# EAGLE design mattduino_uno (EAGLE 9.1.2)

## Sheet 1 of 4
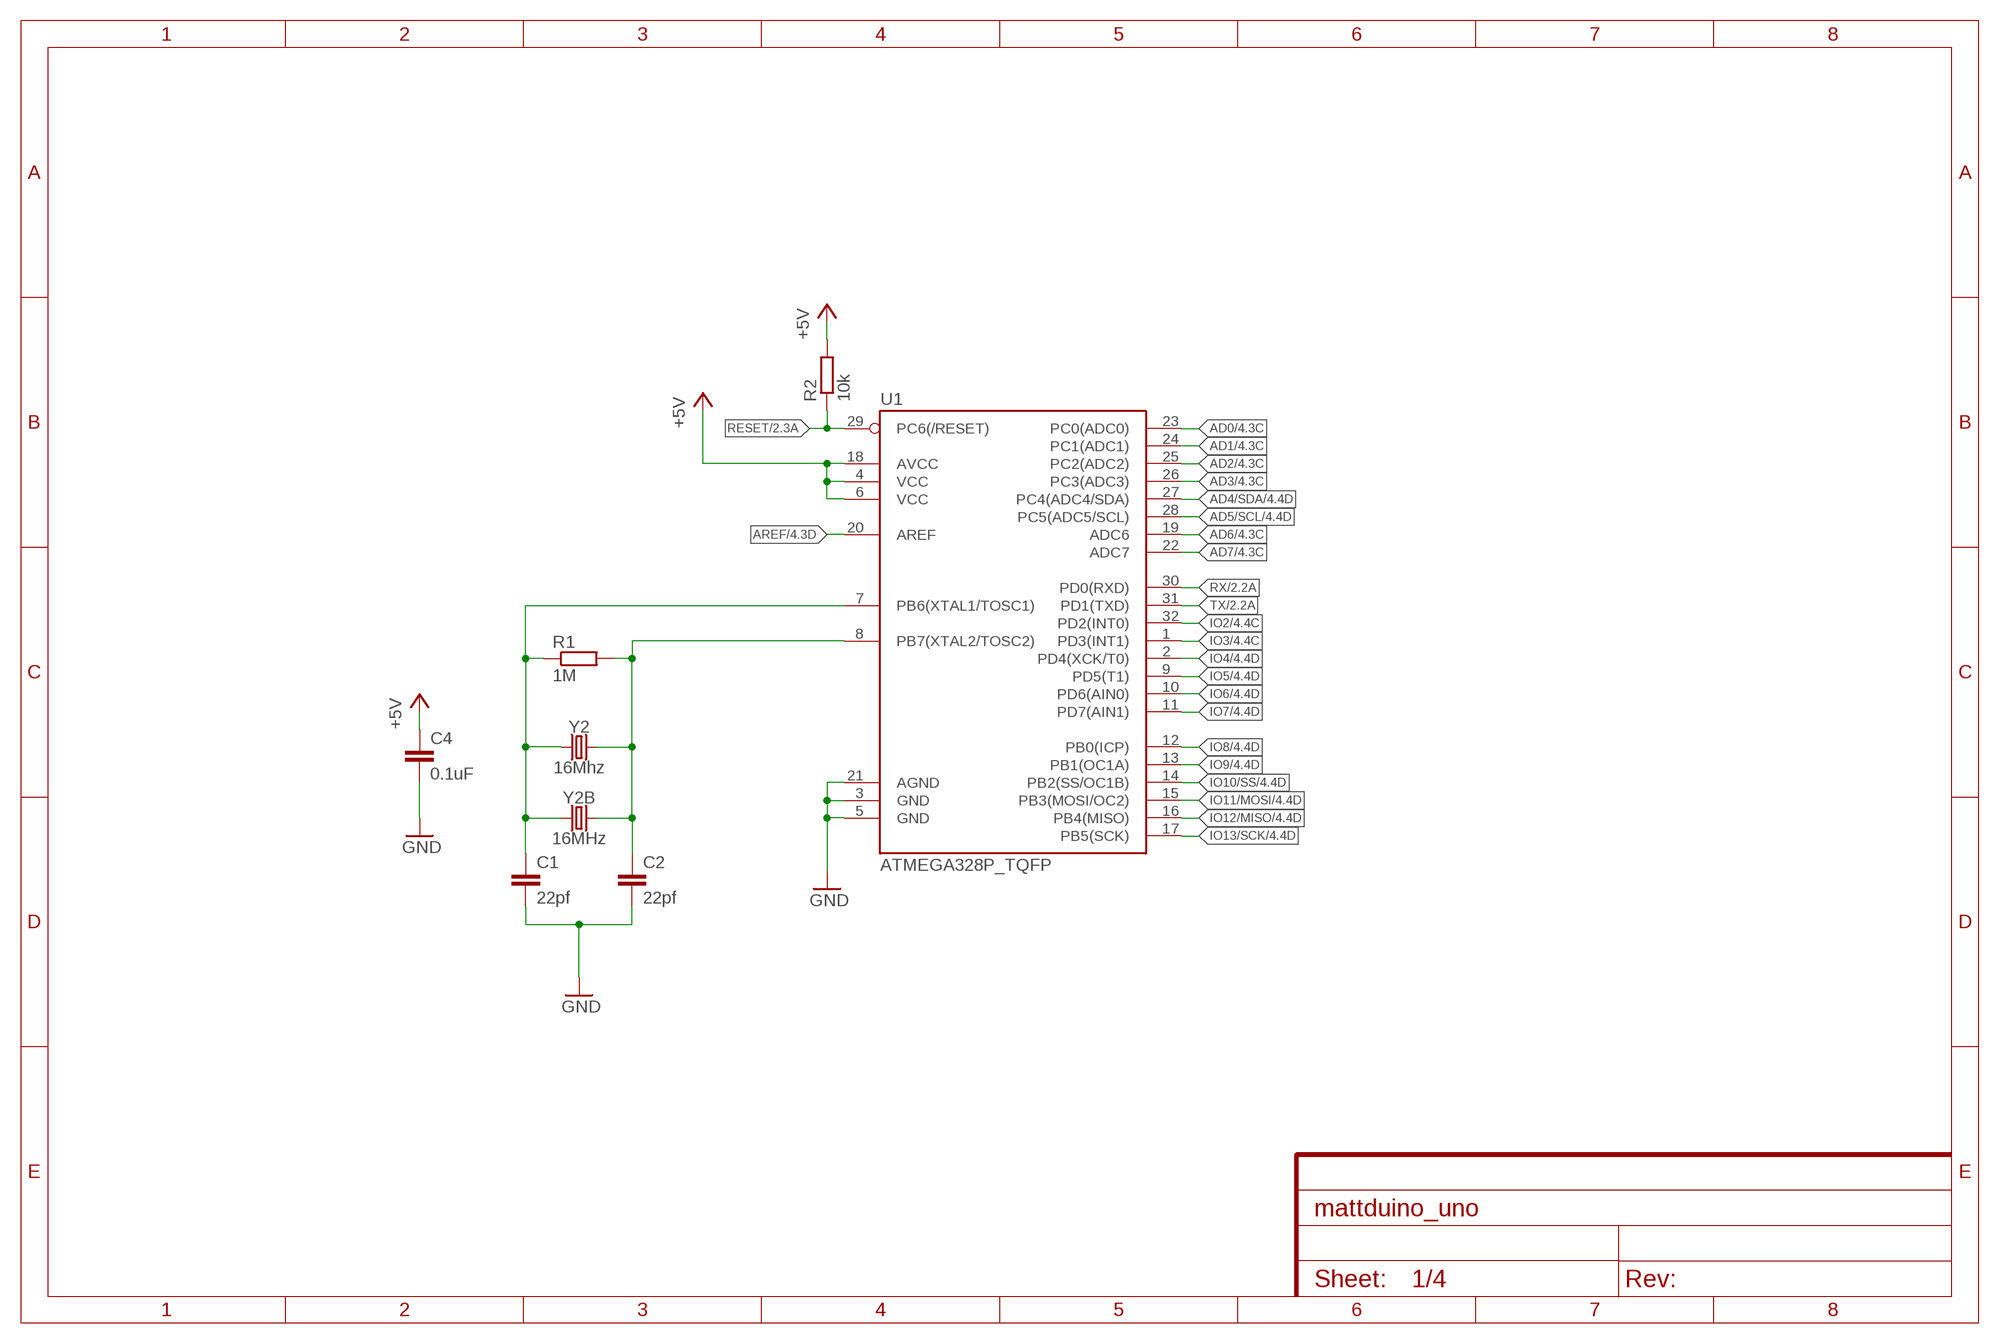
[diagram p0: schematic, sheet 1]

### Parts
C1  22pf  C-EUC0603  [C0603]
C2  22pf  C-EUC0603  [C0603]
C4  0.1uF  C-EUC0603  [C0603]
R1  1M  R-EU_R0603  [R0603]
R2  10k  R-EU_R0603  [R0603]
U1  ATMEGA328P_TQFP  [TQFP32-08]
Y2  16Mhz  CRYSTAL-8MHZSMD-HC49UP  [HC49UP]
Y2B  16MHz  CRYSTALPTH-HC49UV  [HC49U]

### Nets
328_OSC1: C1.1 R1.1 U1.7(PB6(XTAL1/TOSC1)) Y2.1 Y2B.1
328_OSC2: C2.1 R1.2 U1.8(PB7(XTAL2/TOSC2)) Y2.2 Y2B.2
+5V [power usb]: C4.1 R2.2 U1.4(VCC) U1.6(VCC) U1.18(AVCC) ; also sheet 2,3,4
AD0: U1.23(PC0(ADC0)) ; also sheet 4
AD1: U1.24(PC1(ADC1)) ; also sheet 4
AD2: U1.25(PC2(ADC2)) ; also sheet 4
AD3: U1.26(PC3(ADC3)) ; also sheet 4
AD4/SDA: U1.27(PC4(ADC4/SDA)) ; also sheet 4
AD5/SCL: U1.28(PC5(ADC5/SCL)) ; also sheet 4
AD6: U1.19(ADC6) ; also sheet 4
AD7: U1.22(ADC7) ; also sheet 4
AREF: U1.20(AREF) ; also sheet 4
GND [gnd]: C1.2 C2.2 C4.2 U1.3(GND) U1.5(GND) U1.21(AGND) ; also sheet 2,3,4
IO2: U1.32(PD2(INT0)) ; also sheet 4
IO3: U1.1(PD3(INT1)) ; also sheet 4
IO4: U1.2(PD4(XCK/T0)) ; also sheet 4
IO5: U1.9(PD5(T1)) ; also sheet 4
IO6: U1.10(PD6(AIN0)) ; also sheet 4
IO7: U1.11(PD7(AIN1)) ; also sheet 4
IO8: U1.12(PB0(ICP)) ; also sheet 4
IO9: U1.13(PB1(OC1A)) ; also sheet 4
IO10/SS: U1.14(PB2(SS/OC1B)) ; also sheet 4
IO11/MOSI: U1.15(PB3(MOSI/OC2)) ; also sheet 4
IO12/MISO: U1.16(PB4(MISO)) ; also sheet 4
IO13/SCK: U1.17(PB5(SCK)) ; also sheet 4
RESET: R2.1 U1.29(PC6(/RESET)) ; also sheet 2,4
RX: U1.30(PD0(RXD)) ; also sheet 2,4
TX: U1.31(PD1(TXD)) ; also sheet 2,4

## Sheet 2 of 4
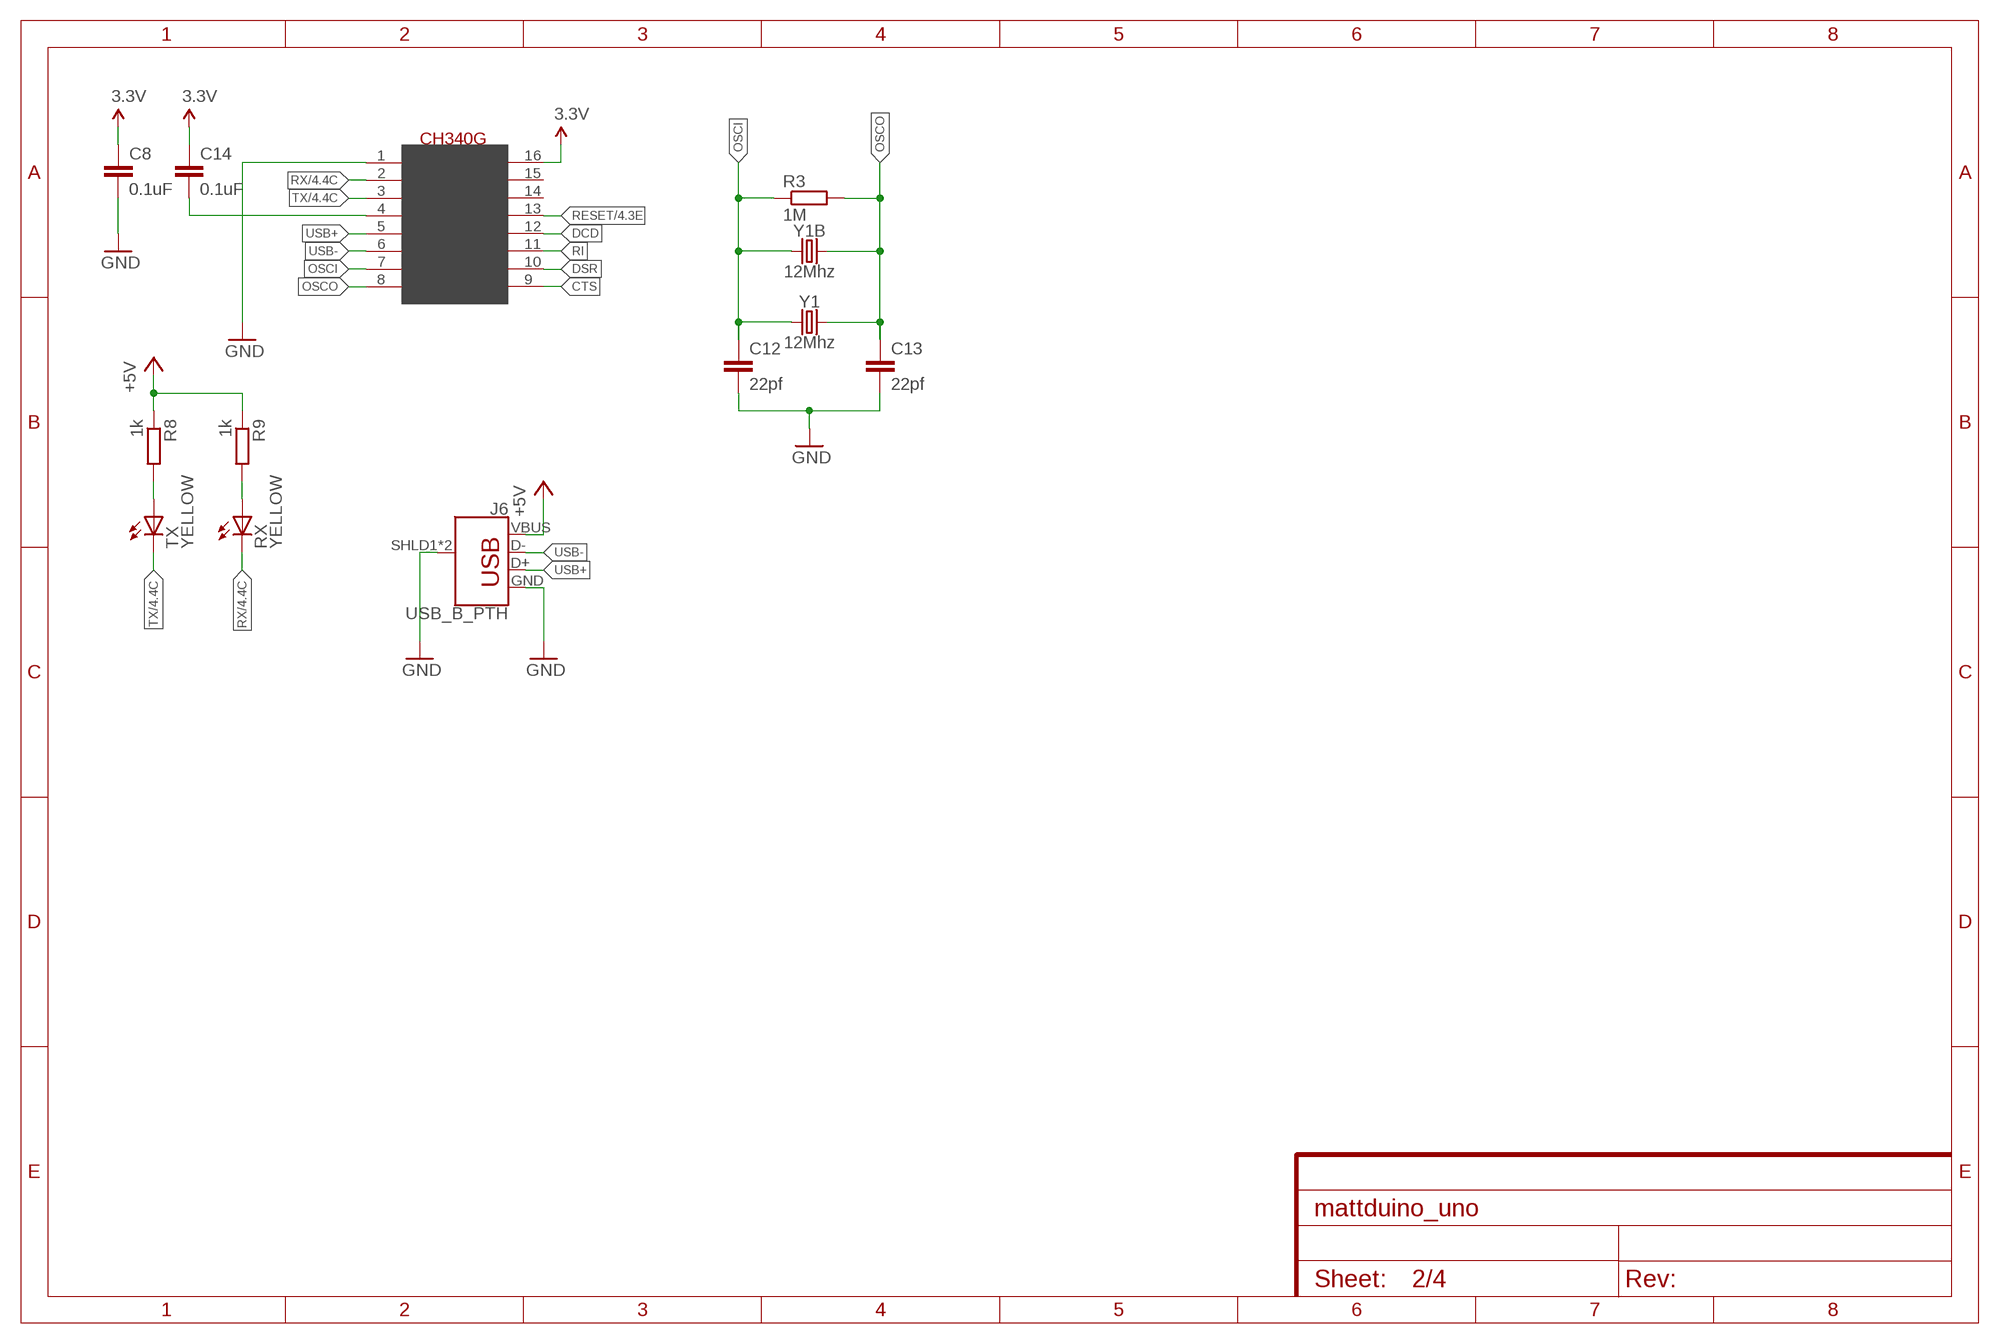
[diagram p1: schematic, sheet 2]

### Parts
C8  0.1uF  C-EUC0603  [C0603]
C12  22pf  C-EUC0603  [C0603]
C13  22pf  C-EUC0603  [C0603]
C14  0.1uF  C-EUC0603  [C0603]
IC3  CH340G  [SOIC16]
J6  USB_B_PTH  [USB-B-PTH]
R3  1M  R-EU_R0603  [R0603]
R8  1k  R-EU_R0603  [R0603]
R9  1k  R-EU_R0603  [R0603]
RX  YELLOW  LEDCHIP-LED0603  [CHIP-LED0603]
TX  YELLOW  LEDCHIP-LED0603  [CHIP-LED0603]
Y1  12Mhz  CRYSTALPTH-HC49UV  [HC49U]
Y1B  12Mhz  CRYSTAL-8MHZSMD-HC49UP  [HC49UP]

### Nets
3.3V: C8.1 C14.1 IC3.16(VCC) ; also sheet 3,4
+5V [power usb]: J6.VBUS R8.1 R9.1 ; also sheet 1,3,4
CTS: IC3.9(CTS)
DCD: IC3.12(DCD)
DSR: IC3.10(DSR)
GND [gnd]: C8.2 C12.2 C13.2 IC3.1(GND) J6.GND J6.SHLD1(SHIELD) J6.SHLD2(SHIELD) ; also sheet 1,3,4
N$5: R8.2 TX.A
N$6: R9.2 RX.A
OSCI: C12.1 IC3.7(XI) R3.1 Y1.1 Y1B.1
OSCO: C13.1 IC3.8(XO) R3.2 Y1.2 Y1B.2
RESET: IC3.13(DTR) ; also sheet 1,4
RI: IC3.11(RI)
RX: IC3.2(TX) RX.C ; also sheet 1,4
TX: IC3.3(RX) TX.C ; also sheet 1,4
USB+: IC3.5(D+) J6.D+
USB-: IC3.6(D-) J6.D-
V3: C14.2 IC3.4(V3)
Unconnected: IC3.14(RTS) IC3.15(RS232)

## Sheet 3 of 4
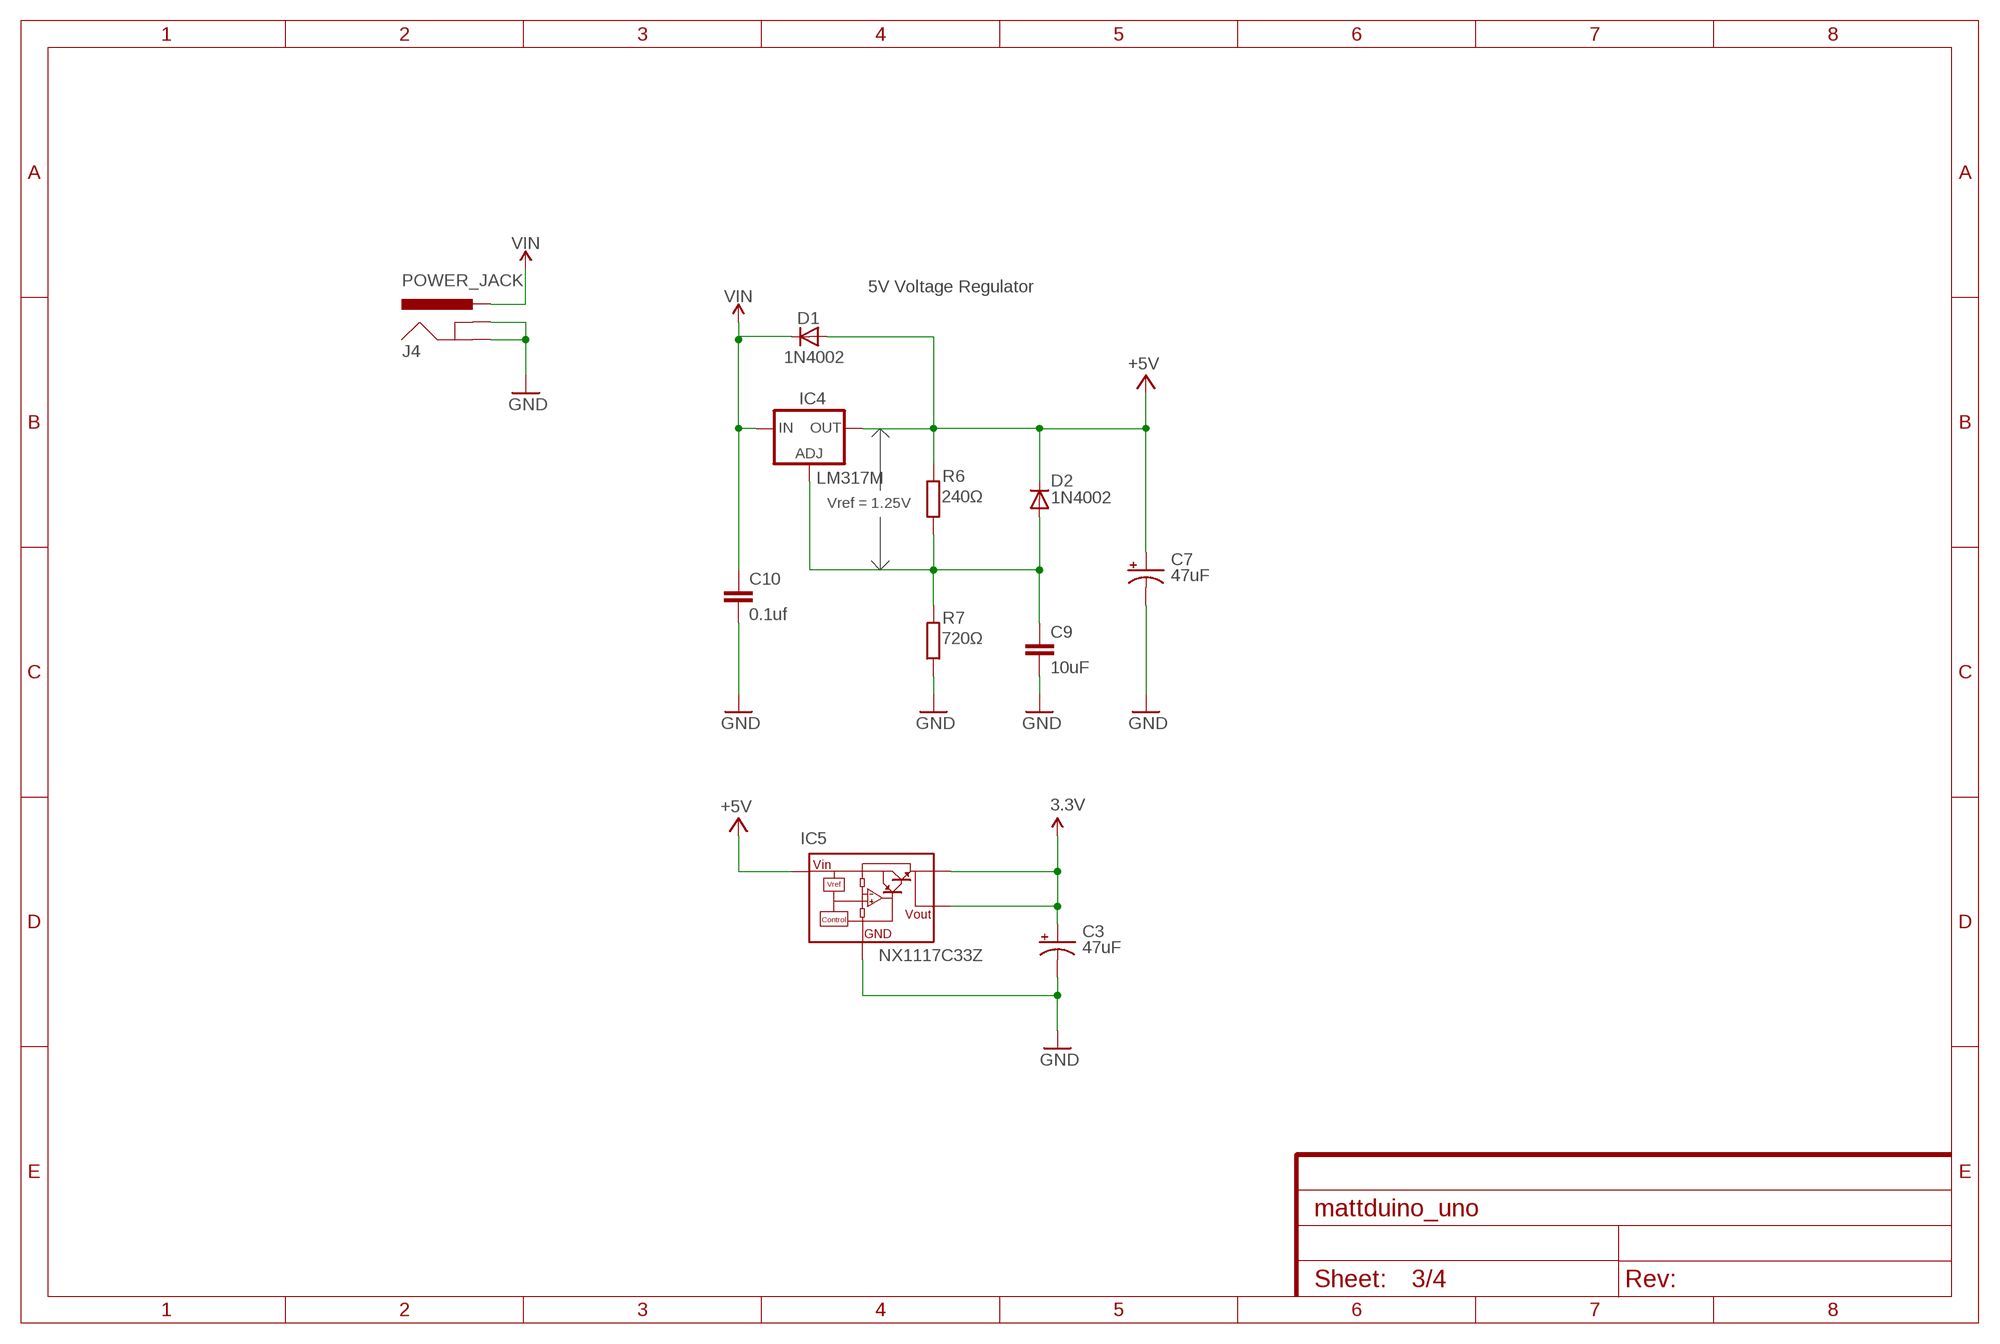
[diagram p2: schematic, sheet 3]

### Parts
C3  47uF  47UF-POLAR-PANASONIC_D-35V-20%  [PANASONIC_D]
C7  47uF  47UF-POLAR-PANASONIC_D-35V-20%  [PANASONIC_D]
C9  10uF  C-EUC0603  [C0603]
C10  0.1uf  C-EUC0603  [C0603]
D1  1N4002  DIODESOD-123  [SOD-123]
D2  1N4002  DIODESOD-123  [SOD-123]
IC4  LM317MBSTT3  [SOT223]
IC5  NX1117C33Z  [SOT223]
J4  POWER_JACK  [POWER_JACK_PTH]
R6  240Ω  R-EU_R0603  [R0603]
R7  720Ω  R-EU_R0603  [R0603]

### Nets
3.3V: C3.+ IC5.2(VOUT1) IC5.4(VOUT) ; also sheet 2,4
+5V [power usb]: C7.+ D1.A D2.C IC4.4(OUT) IC5.3(VIN) R6.2 ; also sheet 1,2,4
GND [gnd]: C3.- C7.- C9.2 C10.2 IC5.1(GND) J4.GND J4.GNDBREAK R7.1 ; also sheet 1,2,4
N$1: C9.1 D2.A IC4.1(ADJ) R6.1 R7.2
VIN: C10.1 D1.C IC4.3(IN) J4.PWR ; also sheet 4

### Notes on the sheet
- 5V Voltage Regulator
- Vref = 1.25V

## Sheet 4 of 4
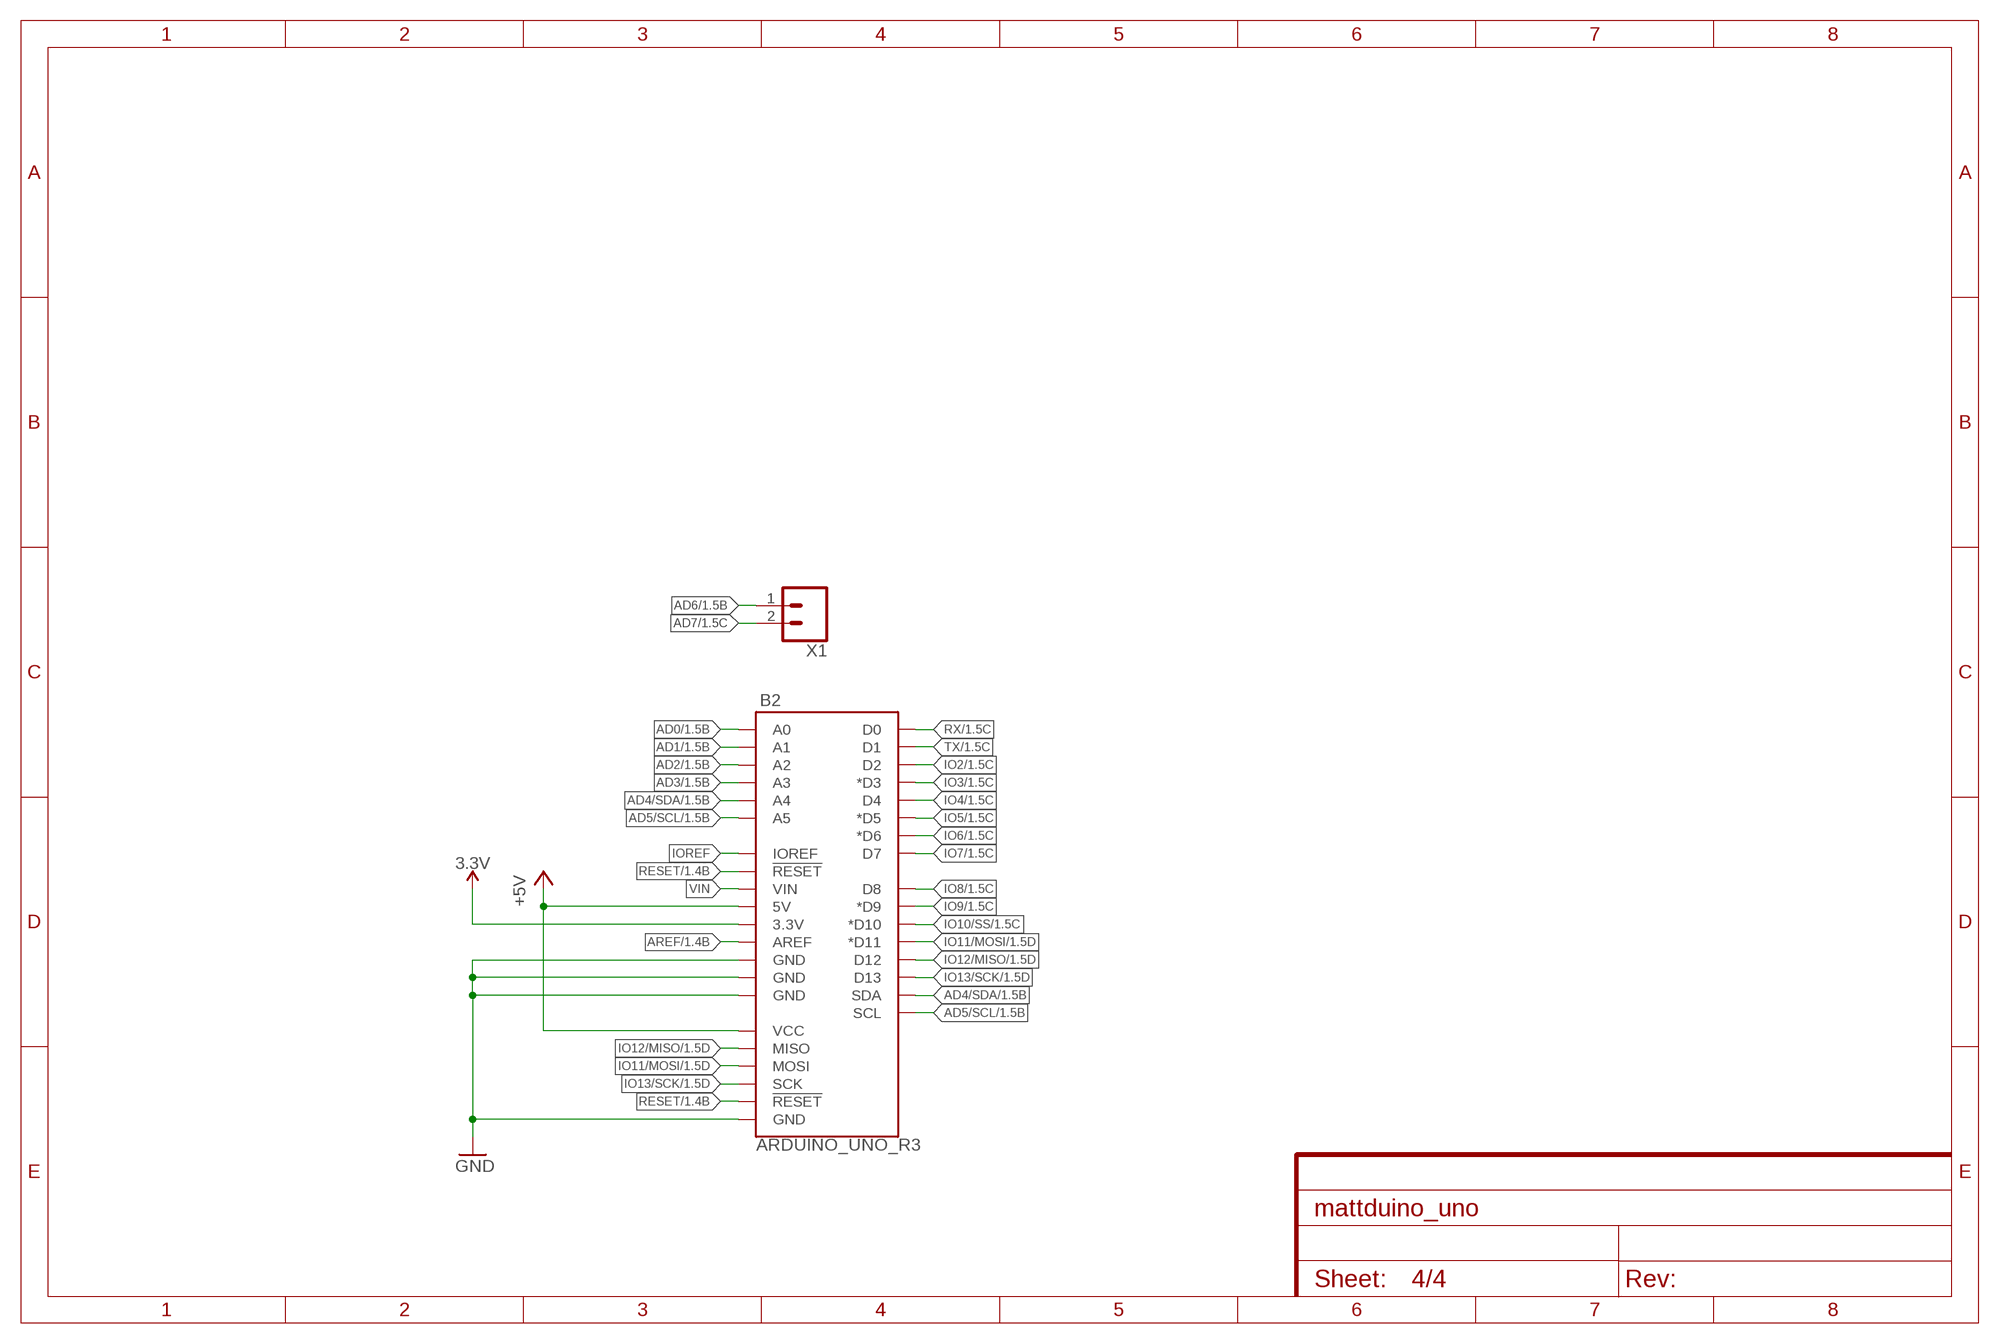
[diagram p3: schematic, sheet 4]

### Parts
B2  ARDUINO_UNO_R3  [ARDUINO_R3]
X1  CONN_02  [1X02]

### Nets
3.3V: B2.3.3V ; also sheet 2,3
+5V [power usb]: B2.5V B2.VCC ; also sheet 1,2,3
AD0: B2.A0 ; also sheet 1
AD1: B2.A1 ; also sheet 1
AD2: B2.A2 ; also sheet 1
AD3: B2.A3 ; also sheet 1
AD4/SDA: B2.A4 B2.SDA ; also sheet 1
AD5/SCL: B2.A5 B2.SCL ; also sheet 1
AD6: X1.1 ; also sheet 1
AD7: X1.2 ; also sheet 1
AREF: B2.AREF ; also sheet 1
GND [gnd]: B2.GND@1(GND) B2.GND@2(GND) B2.GND@3(GND) B2.GND@4(GND) ; also sheet 1,2,3
IO2: B2.D2 ; also sheet 1
IO3: B2.D3(*D3) ; also sheet 1
IO4: B2.D4 ; also sheet 1
IO5: B2.D5(*D5) ; also sheet 1
IO6: B2.D6(*D6) ; also sheet 1
IO7: B2.D7 ; also sheet 1
IO8: B2.D8 ; also sheet 1
IO9: B2.D9(*D9) ; also sheet 1
IO10/SS: B2.D10(*D10) ; also sheet 1
IO11/MOSI: B2.D11(*D11) B2.MOSI ; also sheet 1
IO12/MISO: B2.D12 B2.MISO ; also sheet 1
IO13/SCK: B2.D13 B2.SCK ; also sheet 1
IOREF: B2.IOREF
RESET: B2.RESET@1(!RESET!) B2.RESET@2(!RESET!) ; also sheet 1,2
RX: B2.D0 ; also sheet 1,2
TX: B2.D1 ; also sheet 1,2
VIN: B2.VIN ; also sheet 3

## Library data of the parts
B2 = SparkFun-Boards:ARDUINO_UNO_R3: Arduino R3 Footprint with SPI header Arduino Uno R3 Compatible Footprint. Matches PCB size of the original board. SparkFun Products: SAMD21 Dev Breakout <https://www.sparkfun.com/products/13672> RedBoard <https://www.sparkfun.com/products/12757> R3 Stackable Headers <https://www.sparkfun.com/products/11417>
C1 C2 C4 C8-C10 C12 C14 = rcl:C-EU: CAPACITOR, European symbol; SPICEPREFIX: C
C3 C7 = SparkFun-Capacitors:47UF-POLAR: 47µF polarized capacitors A capacitor is a passive two-terminal electrical component used to store electrical energy temporarily in an electric field.; PROD_ID: CAP-08478
C13 = rcl:C-EU: CAPACITOR, European symbol
D1 D2 = adafruit:DIODE: Diode SMADIODE - SMA Surface Mount Package 20V 1A Schottky Diode Digikey: 641-1014-6-ND DO-1N4148 - Through Hole Small Current Diode SOD-123 20V 1 A (.5mV Vf) Schottky Diode - Digikey: MBRX120TPMSCT-ND SOD-323 10V 570mA (.38mV Vf, 3ns) Schottky Diode - Digikey: ZLLS410CT-ND SOD-523 30V 30mA Schottky Diode (RB751S-40TE61) - Digikey: RB751S-40TE61CT-ND SOT23-R/W - SOT23 Package (R = Solder Paste/Reflow Ovens, W = Hand-Soldering) BAT54Film 40V 300mA - Digikey: 497-7162-1-ND
IC3 = CH340G-USB-SERIAL:CH340G
IC4 = v-reg:LM317?*: 500 mA Adjustable Output Positive Voltage Regulator Source: http://www.onsemi.co.jp .. LM317M-D.PDF; PARTNUMBER: LM317M
IC5 = nxp_60:NX1117C: The NX1117C/NX1117CE are two series of low-dropout positive voltage regulators with an output current capability of 1 A. AAL Eindhoven MK; 12NC: 9352 914 42115; TOLERANCE: 1.25%; VOLTAGE: 5.0V
J4 = SparkFun-Connectors:POWER_JACK: Power Jack Connector This is the standard 5.5mm barrel jack for power. The PTH is the most common, proven, reliable, footprint. The Slot footprint only works if the mill layer is transmitted to the PCB fab house so be warned. Here are the connectors we sell at SparkFun: DC Barrel Power Jack/Connector <https://www.sparkfun.com/products/119> (PRT-00119) DC Barrel Power Jack/Connector (SMD) <https://www.sparkfun.com/products/12748> (PRT-12748) DC Barrel Jack Adapter - Breadboard Compatible <https://www.sparkfun.com/products/10811> (PRT-10811) It is used on this SparkFun product (and many, many others): SparkFun RedBoard - Programmed with Arduino <https://www.sparkfun.com/products/12757> (DEV-12757) Also, if you need a mating power supply or connector, please check these out: Wall Adapter Power Supply - 9VDC 650mA <https://www.sparkfun.com/products/298> (TOL-00298) DC Barrel Jack Adapter - Male <https://www.sparkfun.com/products/10287> (PRT-10287); PROD_ID: CONN-08197
J6 = SparkFun-Connectors:USB_B: USB Type B Connector SparkFun Products: SparkFun Stepoko <https://www.sparkfun.com/products/13899> PTH; PROD_ID: CONN-08278; SF_ID: PRT-00139
R1-R3 R6-R9 = rcl:R-EU_: RESISTOR, European symbol; SPICEPREFIX: R
RX TX = led:LED: LED OSRAM: - CHIPLED LG R971, LG N971, LY N971, LG Q971, LY Q971, LO R971, LY R971 LH N974, LH R974 LS Q976, LO Q976, LY Q976 LO Q996 - Hyper CHIPLED LW Q18S LB Q993, LB Q99A, LB R99A - SideLED LS A670, LO A670, LY A670, LG A670, LP A670 LB A673, LV A673, LT A673, LW A673 LH A674 LY A675 LS A676, LA A676, LO A676, LY A676, LW A676 LS A679, LY A679, LG A679 - Hyper Micro SIDELED® LS Y876, LA Y876, LO Y876, LY Y876 LT Y87S - SmartLED LW L88C, LW L88S LB L89C, LB L89S, LG L890 LS L89K, LO L89K, LY L89K LS L896, LA L896, LO L896, LY L896 - TOPLED LS T670, LO T670, LY T670, LG T670, LP T670 LSG T670, LSP T670, LSY T670, LOP T670, LYG T670 LG T671, LOG T671, LSG T671 LB T673, LV T673, LT T673, LW T673 LH T674 LS T676, LA T676, LO T676, LY T676, LB T676, LH T676, LSB T676, LW T676 LB T67C, LV T67C, LT T67C, LS T67K, LO T67K, LY T67K, LW E67C LS E67B, LA E67B, LO E67B, LY E67B, LB E67C, LV E67C, LT E67C LW T67C LS T679, LY T679, LG T679 LS T770, LO T770, LY T770, LG T770, LP T770 LB T773, LV T773, LT T773, LW T773 LH T774 LS E675, LA E675, LY E675, LS T675 LS T776, LA T776, LO T776, LY T776, LB T776 LHGB T686 LT T68C, LB T68C - Hyper Mini TOPLED® LB M676 - Mini TOPLED Santana® LG M470 LS M47K, LO M47K, LY M47K Source: http://www.osram.convergy.de LUXEON: - LUMILED® LXK2-PW12-R00, LXK2-PW12-S00, LXK2-PW14-U00, LXK2-PW14-V00 LXK2-PM12-R00, LXK2-PM12-S00, LXK2-PM14-U00 LXK2-PE12-Q00, LXK2-PE12-R00, LXK2-PE12-S00, LXK2-PE14-T00, LXK2-PE14-U00 LXK2-PB12-K00, LXK2-PB12-L00, LXK2-PB12-M00, LXK2-PB14-N00, LXK2-PB14-P00, LXK2-PB14-Q00 LXK2-PR12-L00, LXK2-PR12-M00, LXK2-PR14-Q00, LXK2-PR14-R00 LXK2-PD12-Q00, LXK2-PD12-R00, LXK2-PD12-S00 LXK2-PH12-R00, LXK2-PH12-S00 LXK2-PL12-P00, LXK2-PL12-Q00, LXK2-PL12-R00 Source: www.luxeon.com KINGBRIGHT: KA-3528ASYC Source: www.kingbright.com
U1 = SparkFun-IC-Microcontroller:ATMEGA328P_TQFP: Popular 328P in QFP Storefront component: ATmega328 - TQFP <https://www.sparkfun.com/products/13448> (COM-13448) Datasheet <http://www.sparkfun.com/datasheets/Components/SMD/ATMega328.pdf> SparkFun Products SparkFun RedBoard - Programmed with Arduino <https://www.sparkfun.com/products/12757> (DEV-12757) Arduino Pro Mini 328 - 5V/16MHz <https://www.sparkfun.com/products/11113> (DEV-11113) Arduino Pro Mini 328 - 3.3V/8MHz <https://www.sparkfun.com/products/11114> (DEV-11114) SparkFun OpenLog <https://www.sparkfun.com/products/13712> (DEV-13712) SparkFun MicroView - OLED Arduino Module <https://www.sparkfun.com/products/12923> (DEV-12923) SparkFun Digital Sandbox <https://www.sparkfun.com/products/12651> (DEV-12651) SparkFun PicoBoard <https://www.sparkfun.com/products/11888> (WIG-11888) Arduino Fio <https://www.sparkfun.com/products/10116> (DEV-10116) LilyPad Arduino 328 Main Board <https://www.sparkfun.com/products/13342> (DEV-13342) SparkFun RedStick <https://www.sparkfun.com/products/13741> (DEV-13741) LilyPad MP3 <https://www.sparkfun.com/products/11013> (DEV-11013) LilyPad Arduino SimpleSnap <https://www.sparkfun.com/products/10941> (DEV-10941) SparkFun Stepoko <https://www.sparkfun.com/products/13899> (ROB-13899) SparkFun Geiger Counter <https://www.sparkfun.com/products/11345> (SEN-11345) SparkFun EL Sequencer <https://www.sparkfun.com/products/12781> (COM-12781) Arduino Pro 328 - 5V/16MHz <https://www.sparkfun.com/products/10915> (DEV-10915) CryptoCape <https://www.sparkfun.com/products/12773> (DEV-12773) SparkFun IR Thermometer Evaluation Board - MLX90614 <https://www.sparkfun.com/products/10740> (SEN-10740) SparkFun RedBot Mainboard <https://www.sparkfun.com/products/12097> (ROB-12097) Arduino Pro 328 - 3.3V/8MHz <https://www.sparkfun.com/products/10914> (DEV-10914) SparkFun Block for Intel® Edison - Arduino <https://www.sparkfun.com/products/13036> (DEV-13036) SparkFun Simon Says - Surface Mount Soldering Kit <https://www.sparkfun.com/products/10935> (KIT-10935) SparkFun 7-Segment Serial Display - Red <https://www.sparkfun.com/products/11441> (COM-11441) SparkFun 7-Segment Serial Display - White <https://www.sparkfun.com/products/11629> (COM-11629) SparkFun 7-Segment Serial Display - Yellow <https://www.sparkfun.com/products/11443> (COM-11443) SparkFun 7-Segment Serial Display - Kelly Green <https://www.sparkfun.com/products/11440> (COM-11440) SparkFun 7-Segment Serial Display - Blue <https://www.sparkfun.com/products/11442> (COM-11442) SparkFun OpenSegment Serial Display - 20mm (Blue) <https://www.sparkfun.com/products/11647> (COM-11647) SparkFun OpenSegment Serial Display - 20mm (Green) <https://www.sparkfun.com/products/11646> (COM-11646) SparkFun OpenSegment Serial Display - 20mm (White) <https://www.sparkfun.com/products/11648> (COM-11648) SparkFun OpenSegment Serial Display - 20mm (Red) <https://www.sparkfun.com/products/11644> (COM-11644) SparkFun OpenSegment Serial Display - 20mm (Yellow) <https://www.sparkfun.com/products/11645> (COM-11645) SparkFun OpenSegment Shield <https://www.sparkfun.com/products/13190> (DEV-13190); PROD_ID: IC-09069
X1 = SparkFun-Connectors:CONN_02: Multi connection point. Often used as Generic Header-pin footprint for 0.1 inch spaced/style header connections On any of the 0.1 inch spaced packages, you can populate with these: Break Away Headers - Straight <https://www.sparkfun.com/products/116> (PRT-00116) Break Away Male Headers - Right Angle <https://www.sparkfun.com/products/553> (PRT-00553) Female Headers <https://www.sparkfun.com/products/115> (PRT-00115) Break Away Headers - Machine Pin <https://www.sparkfun.com/products/117> (PRT-00117) Break Away Female Headers - Swiss Machine Pin <https://www.sparkfun.com/products/743> (PRT-00743) For SCREWTERMINALS and SPRING TERMINALS visit here: Screw Terimnals on SparkFun.com <https://www.sparkfun.com/search/results?term=Screw+Terminals> (5mm/3.5mm/2.54mm spacing) This device is also useful as a general connection point to wire up your design to another part of your project. Our various solder wires solder well into these plated through hole pads. Hook-Up Wire - Assortment (Stranded, 22 AWG) <https://www.sparkfun.com/products/11375> (PRT-11375) Hook-Up Wire - Assortment (Solid Core, 22 AWG) <https://www.sparkfun.com/products/11367> (PRT-11367) View the entire wire category on our website here <https://www.sparkfun.com/categories/141> Special notes: Molex polarized connector foot print use with: PRT-08233 with associated crimp pins and housings. 2.54_SCREWTERM for use with PRT-10571. 3.5mm Screw Terminal footprints for PRT-08084 5mm Screw Terminal footprints for use with PRT-08432
Y1 Y2B = SparkFun-Clocks:CRYSTAL: Crystals (Generic) These are passive quartz crystals, which can be used as a clock source for a microcontroller. Crystal's are two-terminal devices. They require external "load" capacitors to generate an oscillating signal.
Y1B Y2 = SparkFun-Clocks:CRYSTAL-8MHZ: 8MHz Crystal Datasheet Example <http://www.futureelectronics.com/en/technologies/electromechanical/timing-devices/crystals/Pages/6008189-ABM3B-8.000MHZ-B2-T.aspx?IM=0> Frequency: 8MHz Frequency Tolerance: ±20ppm Load Capacitance: 18pF SparkFun Products: Pro Micro -3.3V/8MHz <https://www.sparkfun.com/products/12587> WAV Trigger <https://www.sparkfun.com/products/13660>; PROD_ID: XTAL-11706; VALUE: 8MHz

## Net classes
2 gnd: width 0.305 mm, drill 0.406 mm, clearance 0.203 mm
3 power usb: width 0.508 mm, drill 0.406 mm, clearance 0.203 mm

## Board
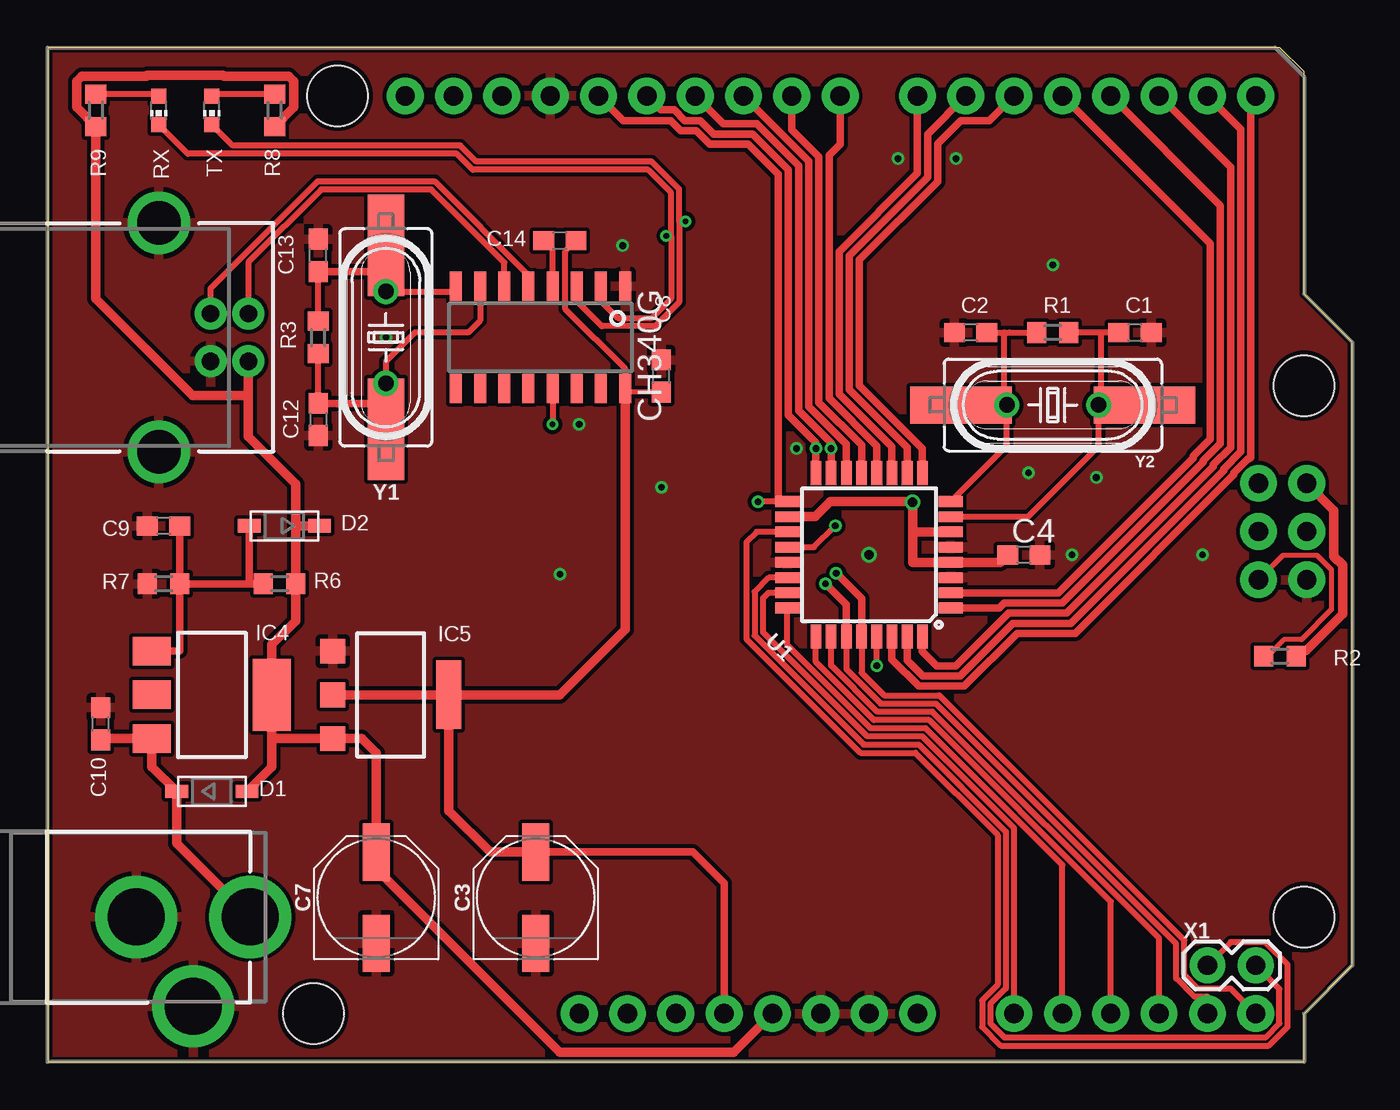
[diagram p4: board, top side]
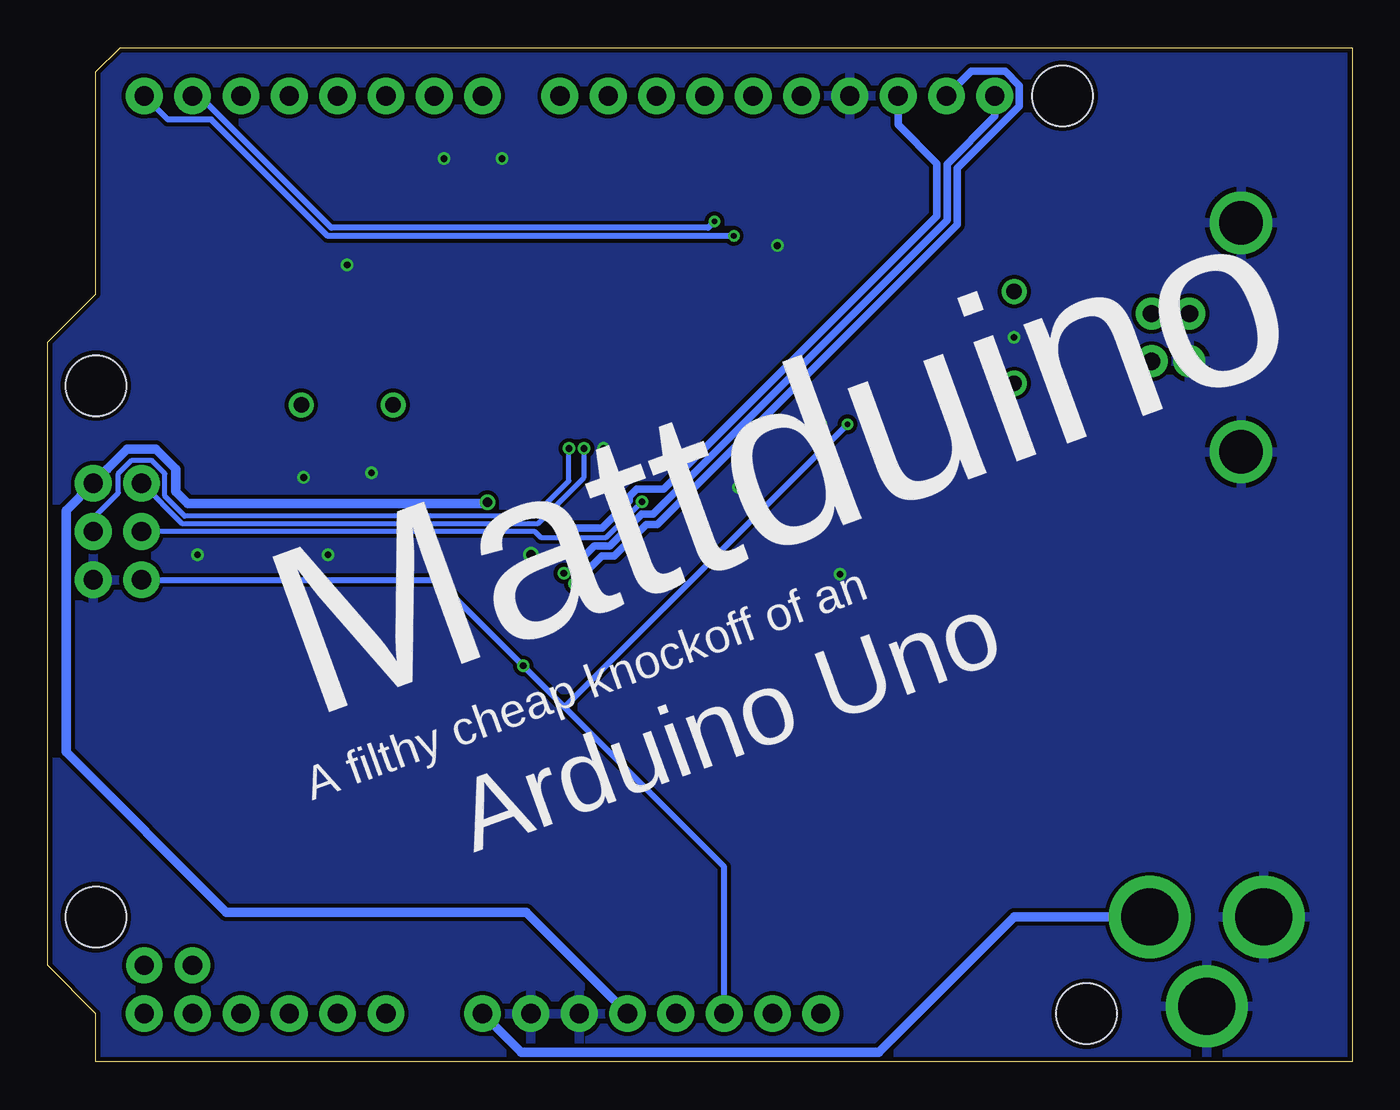
[diagram p5: board, bottom side, seen from below]

Size 68.58 x 53.34 mm. Coordinates in mm from the lower left corner, seen from the top.
Outline: 0,0 66.04,0 66.04,2.54 68.58,5.08 68.58,37.85 66.04,40.39 66.04,52.07 64.77,53.34 0,53.34 0,0
Copper layers (1*16): Top 0.035mm / dielectric 1.5mm / Bottom 0.035mm
Design rules "dirtypcbs": minimum track width 5mil, minimum drill 12mil, track to track 5mil, track to pad 5mil, pad to pad 5mil, via to via 5mil, smd to smd 0mil, copper to edge 10mil, drill to drill 10mil, minimum pad ring 10mil, minimum via ring 6mil, stop-mask expansion 2mil, vias tented up to drill 25mil, thermal gap 10mil

### Footprints (pad centres in the part's own frame; a part is rotated, then mirrored left to right if it is on the bottom)
ARDUINO_R3 = drill 1.016 pad 1.93: 3.3V 2.54,-24.13; 5V 5.08,-24.13; A0 17.78,-24.13; A1 20.32,-24.13; A2 22.86,-24.13; A3 25.4,-24.13; A4 27.94,-24.13; A5 30.48,-24.13; AREF -9.144,24.13; D0 30.48,24.13; D1 27.94,24.13; D2 25.4,24.13; D3 22.86,24.13; D4 20.32,24.13; D5 17.78,24.13; D6 15.24,24.13; D7 12.7,24.13; D8 8.636,24.13; D9 6.096,24.13; D10 3.556,24.13; D11 1.016,24.13; D12 -1.524,24.13; D13 -4.064,24.13; GND@1 7.62,-24.13; GND@2 10.16,-24.13; GND@3 -6.604,24.13; GND@4 33.16,-1.32; IOREF -2.54,-24.13; MISO 30.62,3.76; MOSI 33.16,1.22; NC -5.08,-24.13; RESET@1 0,-24.13; RESET@2 30.62,-1.32; SCK 30.62,1.22; SCL -14.224,24.13; SDA -11.684,24.13; VCC 33.16,3.76; VIN 12.7,-24.13 | hole 3.175: -17.78,24.13; 33.02,8.89; 33.02,-19.05; -19.05,-24.13
C0603 = smd 1.1 x 1: 1 -0.85,0; 2 0.85,0
PANASONIC_D = smd 3 x 1.4: + 2.4,0; - -2.4,0
SOD-123 = smd 1.2 x 0.7: A 1.85,0; C -1.85,0
SOIC16 = smd 0.635 x 1.524: 1 -4.445,-2.695; 2 -3.175,-2.695; 3 -1.905,-2.695; 4 -0.635,-2.695; 5 0.635,-2.695; 6 1.905,-2.695; 7 3.175,-2.695; 8 4.445,-2.695; 9 4.445,2.695; 10 3.175,2.695; 11 1.905,2.695; 12 0.635,2.695; 13 -0.635,2.695; 14 -1.905,2.695; 15 -3.175,2.695; 16 -4.445,2.695
SOT223 = smd 1.5 x 2: 1 -2.3,-3.15; 2 0,-3.15; 3 2.3,-3.15 | smd 3.8 x 2: 4 0,3.15
SOT223' = smd 1.3 x 1.3: 1 -2.3,-3.05; 2 0,-3.05; 3 2.3,-3.05 | smd 3.6 x 1.3: 4 0,3.05
POWER_JACK_PTH = drill 2.997 pad 4.318: GND 0,7.7; GNDBREAK 4.7,10.7; PWR 0,13.7
USB-B-PTH = drill 0.914 pad 1.676: D+ 4,1.25; D- 5.981,1.25; GND 4,-1.25; VBUS 5.981,-1.25 | drill 2.286: SHLD1 1.282,-6.02; SHLD2 1.282,6.02
R0603 = smd 1 x 1.1: 1 -0.85,0; 2 0.85,0
CHIP-LED0603 = smd 0.8 x 0.8: A 0,-0.75; C 0,0.75
TQFP32-08 = smd 1.27 x 0.559: 1 -4.293,2.8; 2 -4.293,2; 3 -4.293,1.2; 4 -4.293,0.4; 5 -4.293,-0.4; 6 -4.293,-1.2; 7 -4.293,-2; 8 -4.293,-2.8; 17 4.293,-2.8; 18 4.293,-2; 19 4.293,-1.2; 20 4.293,-0.4; 21 4.293,0.4; 22 4.293,1.2; 23 4.293,2; 24 4.293,2.8 | smd 0.559 x 1.27: 9 -2.8,-4.293; 10 -2,-4.293; 11 -1.2,-4.293; 12 -0.4,-4.293; 13 0.4,-4.293; 14 1.2,-4.293; 15 2,-4.293; 16 2.8,-4.293; 25 2.8,4.293; 26 2,4.293; 27 1.2,4.293; 28 0.4,4.293; 29 -0.4,4.293; 30 -1.2,4.293; 31 -2,4.293; 32 -2.8,4.293
1X02 = drill 1.016 pad 1.88: 1 0,0; 2 2.54,0
HC49U = drill 0.813: 1 -2.413,0; 2 2.413,0
HC49UP = smd 5.334 x 1.93: 1 -4.826,0; 2 4.826,0

### Placement (x,y rotation side)
B2  33.02,26.67 0 top
C1  57.15,38.35 0 top
C2  48.51,38.35 180 top
C3  25.65,8.64 90 top
C4  51.31,26.67 0 top
C7  17.27,8.64 90 top
C8  32.26,36.07 90 top
C9  6.1,28.19 180 top
C10  2.79,17.78 90 top
C12  14.22,33.78 270 top
C13  14.22,42.42 90 top
C14  26.92,43.18 180 top
D1  8.64,14.22 0 top
D2  12.45,28.19 180 top
IC3  25.91,38.1 180 top
IC4  8.64,19.3 270 top
IC5  NX1117C33Z  [SOT223']  18.03,19.3 270 top
J4  -3.05,7.62 270 top
J6  4.57,38.1 0 top
R1  52.83,38.35 180 top
R2  64.77,21.34 0 top
R3  14.22,38.1 90 top
R6  12.19,25.15 0 top
R7  6.1,25.15 0 top
R8  11.94,50.04 90 top
R9  2.54,50.04 90 top
RX  5.84,50.04 180 top
TX  8.64,50.04 180 top
U1  43.18,26.67 180 top
X1  60.96,5.08 0 top
Y1  17.78,38.1 90 top
Y1B  17.78,38.1 90 top
Y2  52.83,34.54 180 top
Y2B  52.83,34.54 180 top

### Tracks (layer width: path | path; a pad name or v marks a point on that pad's centre or on a via)
3.3V
  Top 0.254: C8.1 30.52,35.22 30.35,35.05
  Top 0.305: IC3.16 30.35,36.45 27.22,39.59 27.22,42.62 C14.1 | 30.35,33.27 30.35,31.75 30.35,30.98
  Top 0.406: B2.3.3V 35.56,9.4 33.92,11.04 C3.+
  Top 0.508: IC5.2 IC5.4 | C3.+ 23.25,11.04 21.08,13.21 IC5.4 | IC3.16 30.35,35.05 30.35,33.27 30.35,31.75 30.35,22.73 26.92,19.3 IC5.4
328_OSC1
  Top 0.305: U1.7 51.53,28.67 55.24,32.38 Y2B.1 Y2.1 55.37,34.54 55.37,38.35 | C1.1 55.37,38.35 | 55.37,38.35 R1.1
328_OSC2
  Top 0.305: U1.8 50.42,32.42 Y2B.2 Y2.2 50.29,34.54 50.29,38.35 | C2.1 50.29,38.35 | 50.29,38.35 50.55,38.35 R1.2
+5V  (via drill 0.5)
  Top 0.508: B2.5V 36.07,0.51 26.92,0.51 17.27,10.16 C7.+ 17.27,16.26 16.51,17.02 16.5,17 IC5.3 11.8,17 11.79,17.02 | 11.79,17.02 IC4.4 11.79,21.95 13.04,23.2 R6.2 13.04,28.19 | 11.79,17.02 11.79,15.52 D1.A | U1.6 45.47,27.87 | 45.47,27.87 v45.47,29.44 45.44,29.46 41.15,29.46 40.35,28.67 U1.18 | 45.47,27.87 45.47,26.27 U1.4 50.06,26.27 C4.1 | 13.04,28.19 13.04,30.39 10.55,32.88 10.55,35.05 | 10.55,35.05 J6.VBUS | D2.C 13.04,28.19 | 10.55,35.05 7.62,35.05 2.54,40.13 R9.1 1.53,50.2 1.53,51.58 1.8,51.84 5.21,51.84 5.24,51.87 9.24,51.87 9.27,51.84 12.68,51.84 12.95,51.58 12.95,50.2 R8.1 | B2.VCC 67.6,29.01 67.6,26.59 68.06,26.13 68.06,23.55 66.15,21.63 65.92,21.63 R2.2
  Bottom 0.508: B2.5V 43.43,7.87 59.18,7.87 67.6,16.29 67.6,29.01 B2.VCC 65.44,31.17 65.44,31.18 64.39,32.23 62.89,32.23 61.84,31.18 61.84,29.99 61.21,29.36 45.47,29.36 v45.47,29.44
AD0
  Top 0.305: B2.A0 50.8,12.29 45.97,17.12 43.07,17.12 37.59,22.6 37.59,24.38 37.88,24.67 U1.23
AD1
  Top 0.305: B2.A1 53.34,10.36 46.15,17.55 43.25,17.55 38.89,21.92 U1.24
AD2
  Top 0.305: B2.A2 55.88,8.43 46.33,17.98 43.43,17.98 40.38,21.03 U1.25
AD3
  Top 0.305: B2.A3 58.42,6.5 46.51,18.41 43.61,18.41 41.18,20.84 U1.26
AD4/SDA  (via drill 0.35)
  Top 0.305: B2.A4 60.96,3.43 60.28,3.43 59.31,4.4 59.31,6.22 46.69,18.85 43.79,18.85 41.98,20.66 U1.27
  Top 0.406: U1.27 41.98,24.06 v40.89,25.15
  Bottom 0.406: B2.SDA 20.04,52.09 18.26,52.09 17.5,51.34 17.5,50.26 20.77,46.99 20.77,44.03 36.53,28.27 37.13,28.27 38.8,26.6 39.44,26.6 v40.89,25.15
AD5/SCL  (via drill 0.35)
  Top 0.305: B2.A5 62.18,3.86 60.45,3.86 59.74,4.58 59.74,6.4 46.86,19.28 43.97,19.28 42.78,20.47 U1.28
  Top 0.406: U1.28 42.78,24.37 v41.45,25.7
  Bottom 0.406: v41.45,25.7 41.27,25.7 39.84,27.13 39.02,27.13 37.35,28.81 36.75,28.81 21.3,44.25 21.3,47.21 18.8,49.72 B2.SCL
AD6
  Top 0.305: U1.19 37.27,27.87 36.73,27.33 36.73,22.24 42.72,16.26 45.61,16.26 49.94,11.93 49.94,4.05 49.12,3.23 49.12,1.85 50.11,0.86 64.19,0.86 65.18,1.85 65.18,5.13 64,6.3 62.18,6.3 X1.1
AD7
  Top 0.305: U1.22 37.92,25.47 37.16,24.71 37.16,22.42 42.89,16.69 45.79,16.69 50.37,12.11 50.37,3.87 49.55,3.06 49.55,2.02 50.28,1.29 64.02,1.29 64.75,2.02 64.75,3.83 X1.2
AREF  (via drill 0.35)
  Top 0.305: U1.20 40.28,27.07 v41.4,28.19
  Bottom 0.406: v41.4,28.19 41.28,28.07 39.41,28.07 38,29.49 38,29.74 37.61,30.12 36.19,30.12 35.82,30.49 29.22,37.09 | B2.AREF 23.88,49.28 21.84,47.24 21.84,44.47 29.22,37.09 | 29.22,37.09
GND  (via drill 0.35, 0.5)
  other vias: 43.18,26.67 30.23,42.93 44.7,47.5 47.75,47.5 27.94,33.53 32.26,30.23 26.92,25.65 39.37,32.26 53.85,26.67 52.83,41.91 55.12,30.73 60.71,26.67 51.56,30.99 17.78,38.1
  pour Top: 0,0 68.58,0 68.58,53.34 0,53.34
  pour Bottom: 0,0 68.58,0 68.58,53.34 0,53.34
IO2
  Top 0.406: U1.32 45.97,21.59 46.74,20.83 47.74,20.83 50.51,23.6 53.56,23.6 61.28,31.32 61.28,31.41 62.18,32.31 62.18,47.04 B2.D2
IO3
  Top 0.406: U1.1 50.02,23.87 50.29,24.14 53.34,24.14 60.74,31.54 60.74,31.63 61.65,32.53 61.65,45.03 B2.D3
IO4
  Top 0.406: U1.2 53.12,24.67 60.21,31.76 60.21,31.85 61.11,32.75 61.11,43.03 B2.D4
IO5
  Top 0.406: B2.D5 49.51,49.51 48.01,49.51 46.79,48.28 46.79,46.29 42.67,42.18 42.67,35.57 45.98,32.26 U1.9
IO6
  Top 0.406: B2.D6 46.25,48.79 46.25,46.52 42.14,42.4 42.14,35.34 45.18,32.3 U1.10
IO7
  Top 0.406: B2.D7 45.72,46.74 41.6,42.62 41.6,35.12 44.38,32.35 U1.11
IO8
  Top 0.406: B2.D8 41.66,48.26 41.07,47.68 41.07,34.9 43.58,32.4 U1.12
IO9
  Top 0.406: B2.D9 39.12,49.02 40.54,47.6 40.54,34.68 42.78,32.44 U1.13
IO10/SS
  Top 0.406: B2.D10 40.01,47.37 40.01,34.46 41.98,32.49 U1.14
IO11/MOSI  (via drill 0.35)
  Top 0.406: U1.15 v41.18,32.26 41.18,32.53 39.47,34.24 39.47,47.13 37.27,49.33 35.51,49.33 B2.D11
  Bottom 0.254: B2.MOSI 66.18,28.6 64.86,29.92 64.86,30.93 64.14,31.65 63.13,31.65 62.42,30.93 62.42,29.75 61.38,28.7 43.03,28.7 41.18,30.55 v41.18,32.26
IO12/MISO  (via drill 0.35)
  Top 0.406: U1.16 v40.38,32.26 40.38,32.58 38.94,34.02 38.94,46.91 37.05,48.79 35.02,48.79 34.31,49.51 33.5,49.51 32.94,50.06 32.23,50.06 B2.D12
  Bottom 0.254: v40.38,32.26 40.38,30.74 42.8,28.32 61.53,28.32 B2.MISO
IO13/SCK  (via drill 0.35)
  Top 0.305: U1.17 38.61,29.46 v37.34,29.46
  Top 0.406: 38.41,34.05 38.41,35.05 | 38.41,35.05 38.41,46.69 36.83,48.26 34.8,48.26 34.09,48.97 33.28,48.97 32.74,49.51 30.25,49.51 B2.D13 | 38.41,35.05 38.41,29.67 38.61,29.46
  Bottom 0.254: v37.34,29.46 39.22,27.59 42.67,27.59 42.98,27.89 B2.SCK
N$1
  Top 0.406: IC4.1 6.95,21.6 R7.2 | R7.2 C9.1 | R7.2 10.92,25.15 | 10.92,25.15 R6.1 | D2.A 10.6,25.15 10.92,25.15
N$5
  Top 0.305: R8.2 8.66,50.89
  Top 0.508: 8.66,50.89 TX.A
N$6
  Top 0.305: RX.A 5.74,50.89 R9.2
OSCI
  Top 0.305: IC3.7 22.73,38.99 22.1,38.35 19.3,38.35 17.78,36.83 Y1.1 | C12.1 R3.1
  Top 0.406: Y1B.1 Y1.1 17.78,34.63 C12.1
OSCO
  Top 0.305: Y1.2 21.18,40.51 IC3.8 | R3.2 C13.1
  Top 0.406: Y1B.2 Y1.2 17.78,41.57 C13.1
RESET  (via drill 0.3, 0.35)
  Top 0.254: B2.RESET@2 64.94,26.64 66.72,26.64 67.47,25.89 67.47,23.79 65.9,22.22 64.98,22.22 64.1,21.34 R2.1
  Top 0.305: v43.58,20.83 U1.29 | IC3.13 v26.54,33.53
  Bottom 0.305: B2.RESET@2 48.1,25.35 v43.58,20.83 41.48,18.72 | B2.RESET@1 33.02,10.27 41.48,18.72 | v26.54,33.53 41.35,18.72 41.48,18.72
RX  (via drill 0.3)
  Top 0.305: IC3.2 29.08,40.01 29.97,39.12 31.75,39.12 32.77,40.13 32.77,43.43 | 32.77,43.43 32.77,45.21 32.77,45.72 31.57,46.91 22.35,46.91 21.51,47.75 7.38,47.75 RX.C | v32.51,43.43 32.77,43.43
  Top 0.406: U1.30 44.38,21.16 45.78,19.76 48.18,19.76 50.95,22.54 54,22.54 62.34,30.88 62.34,30.97 63.1,31.73 63.19,31.73 63.25,31.78 63.25,50.55 B2.D0
  Bottom 0.305: v32.51,43.43 53.85,43.43 59.97,49.55 62.26,49.55 B2.D0
TX  (via drill 0.3)
  Top 0.305: 33.2,44.2 33.2,45.9 31.75,47.35 22.53,47.35 21.69,48.18 9.74,48.18 TX.C | 33.2,44.2 33.2,39.95 31.93,38.68 29.13,38.68 27.81,40.01 IC3.3 | v33.53,44.2 33.2,44.2
  Top 0.406: U1.31 45.18,21.11 46,20.3 47.96,20.3 50.73,23.07 53.78,23.07 61.81,31.1 61.81,31.19 62.71,32.09 62.71,49.05 B2.D1
  Bottom 0.305: v33.53,44.2 33.86,43.87 53.67,43.87 60.6,50.8 B2.D1
USB+
  Top 0.305: J6.D+ 8.57,40.68 14.2,46.3 20.35,46.3 25.27,41.38 IC3.5
USB-
  Top 0.305: J6.D- 10.55,42.05 14.38,45.87 20.17,45.87 24,42.04 IC3.6
V3
  Top 0.305: IC3.4 26.54,42.71 C14.2
VIN
  Top 0.508: J4.PWR 6.79,11.49 D1.C 5.49,15.52 IC4.3 2.81,17 C10.1
  Bottom 0.508: B2.VIN 43.69,0.51 24.89,0.51 17.78,7.62 J4.PWR

### Text on the board
bPlace: Mattduino | A filthy cheap knockoff of an | Arduino Uno